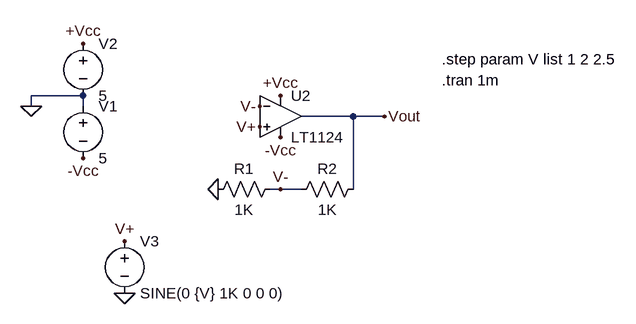
[diagram p0: schematic 3η εργαστηριακή άσκηση - 2.asc]
3η εργαστηριακή άσκηση - 2.asc, the LTspice schematic file:
Version 4
SHEET 1 880 680
WIRE 16 96 -64 96
WIRE -64 112 -64 96
WIRE 16 112 16 96
WIRE 432 128 352 128
WIRE 480 128 432 128
WIRE 320 240 304 240
WIRE 352 240 320 240
WIRE 432 240 432 128
FLAG -64 112 0
FLAG 80 400 0
FLAG 224 240 0
FLAG 480 128 Vout
FLAG 320 240 V-
FLAG 288 112 V-
FLAG 288 144 V+
FLAG 80 320 V+
FLAG 16 16 +Vcc
FLAG 16 192 -Vcc
FLAG 320 96 +Vcc
FLAG 320 160 -Vcc
SYMBOL voltage 16 96 R0
WINDOW 123 0 0 Left 0
WINDOW 39 0 0 Left 0
SYMATTR InstName V1
SYMATTR Value 5
SYMBOL voltage 16 0 R0
WINDOW 123 0 0 Left 0
WINDOW 39 0 0 Left 0
SYMATTR InstName V2
SYMATTR Value 5
SYMBOL voltage 80 304 R0
WINDOW 123 0 0 Left 0
WINDOW 39 0 0 Left 0
SYMATTR InstName V3
SYMATTR Value SINE(0 {V} 1K 0 0 0)
SYMBOL res 320 224 R90
WINDOW 0 0 56 VBottom 2
WINDOW 3 32 56 VTop 2
SYMATTR InstName R1
SYMATTR Value 1K
SYMBOL res 448 224 R90
WINDOW 0 0 56 VBottom 2
WINDOW 3 32 56 VTop 2
SYMATTR InstName R2
SYMATTR Value 1K
SYMBOL OpAmps\\LT1124 320 64 R0
SYMATTR InstName U2
TEXT 568 40 Left 2 !.step param V list 1 2 2.5
TEXT 568 72 Left 2 !.tran 1m

The netlist it stands for:
* 3η εργαστηριακή άσκηση - 2.asc
V1 0 -Vcc 5
V2 +Vcc 0 5
V3 V+ 0 SINE(0 {V} 1K 0 0 0)
R1 V- 0 1K
R2 Vout V- 1K
XU2 V+ V- +Vcc -Vcc Vout LT1124  ; pins In+ In- V+ V- OUT
.step param V list 1 2 2.5
.tran 1m
.lib LTC.lib
.backanno
.end